# Altium schematic sheet sub_sheet.SchDoc
size A4; SheetNumber: 2; SheetTotal: 2
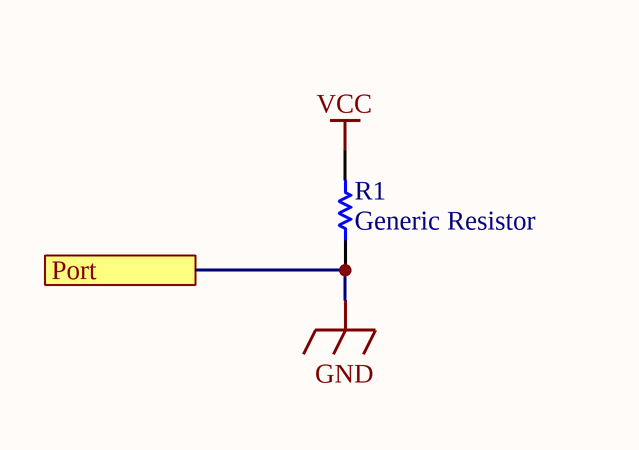
[diagram p0: sub_sheet.SchDoc]

## Parts
R1  Generic Resistor

## Ports
Port

## Nets
GND: R1.1 ; port Port
VCC: R1.2

## Library data of the parts
R1 = CMP-441e8da1a4a89bd9-1: Lead Length: 10mm; Power Rating: 2.00 W; ELV Compliant: Compliant; Resistance Tolerance: ±5%; Resistance: 100 Ω; Temperature Coefficient: -350 ppm/°C to 350 ppm/°C; Voltage Rating (DC): 350 V; Packaging: Ammo Pack; OctopartID: 441e8da1a4a89bd9; RoHS: Compliant; Lifecycle Status: Active; REACH SVHC Compliance: No SVHC; Operating Temperature: -55.0 °C to 235 °C; Mounting Style: Axial; Number of Pins: 2